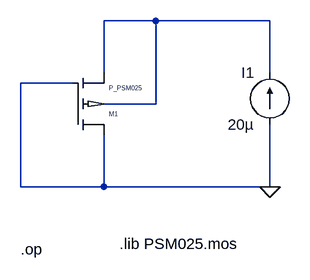
[diagram p0: schematic operating_point_pmos.asc]
operating_point_pmos.asc, the LTspice schematic file:
Version 4
SHEET 1 880 680
WIRE 128 32 48 32
WIRE 304 32 128 32
WIRE 48 112 48 32
WIRE 304 112 304 32
WIRE 0 128 -80 128
WIRE 128 160 128 32
WIRE 128 160 48 160
WIRE -80 288 -80 128
WIRE 48 288 48 208
WIRE 48 288 -80 288
WIRE 304 288 304 192
WIRE 304 288 48 288
FLAG 304 288 0
SYMBOL current 304 192 R180
WINDOW 0 24 80 Left 2
WINDOW 3 24 0 Left 2
WINDOW 123 0 0 Left 2
WINDOW 39 0 0 Left 2
SYMATTR InstName I1
SYMATTR Value 20µ
SYMBOL P_PSM025 0 208 M180
SYMATTR InstName M1
SYMATTR Value2 l=1u w=16.2u
TEXT -80 384 Left 2 !.op
TEXT 72 376 Left 2 !.lib PSM025.mos

The netlist it stands for:
* operating_point_pmos.asc
I1 0 N001 20µ
M1 0 0 N001 N001 P_PSM025 l=1u w=16.2u
.model NMOS NMOS
.model PMOS PMOS
.lib standard.mos
.op
.lib PSM025.mos
.backanno
.end